# EasyEDA schematic Electronic Dice Schematic.json
TITLE: Sheet_1; REV: 1.0; Date: 2026-03-09; Sheet: 1/1; Drawn By: 752718; Company: Your Company
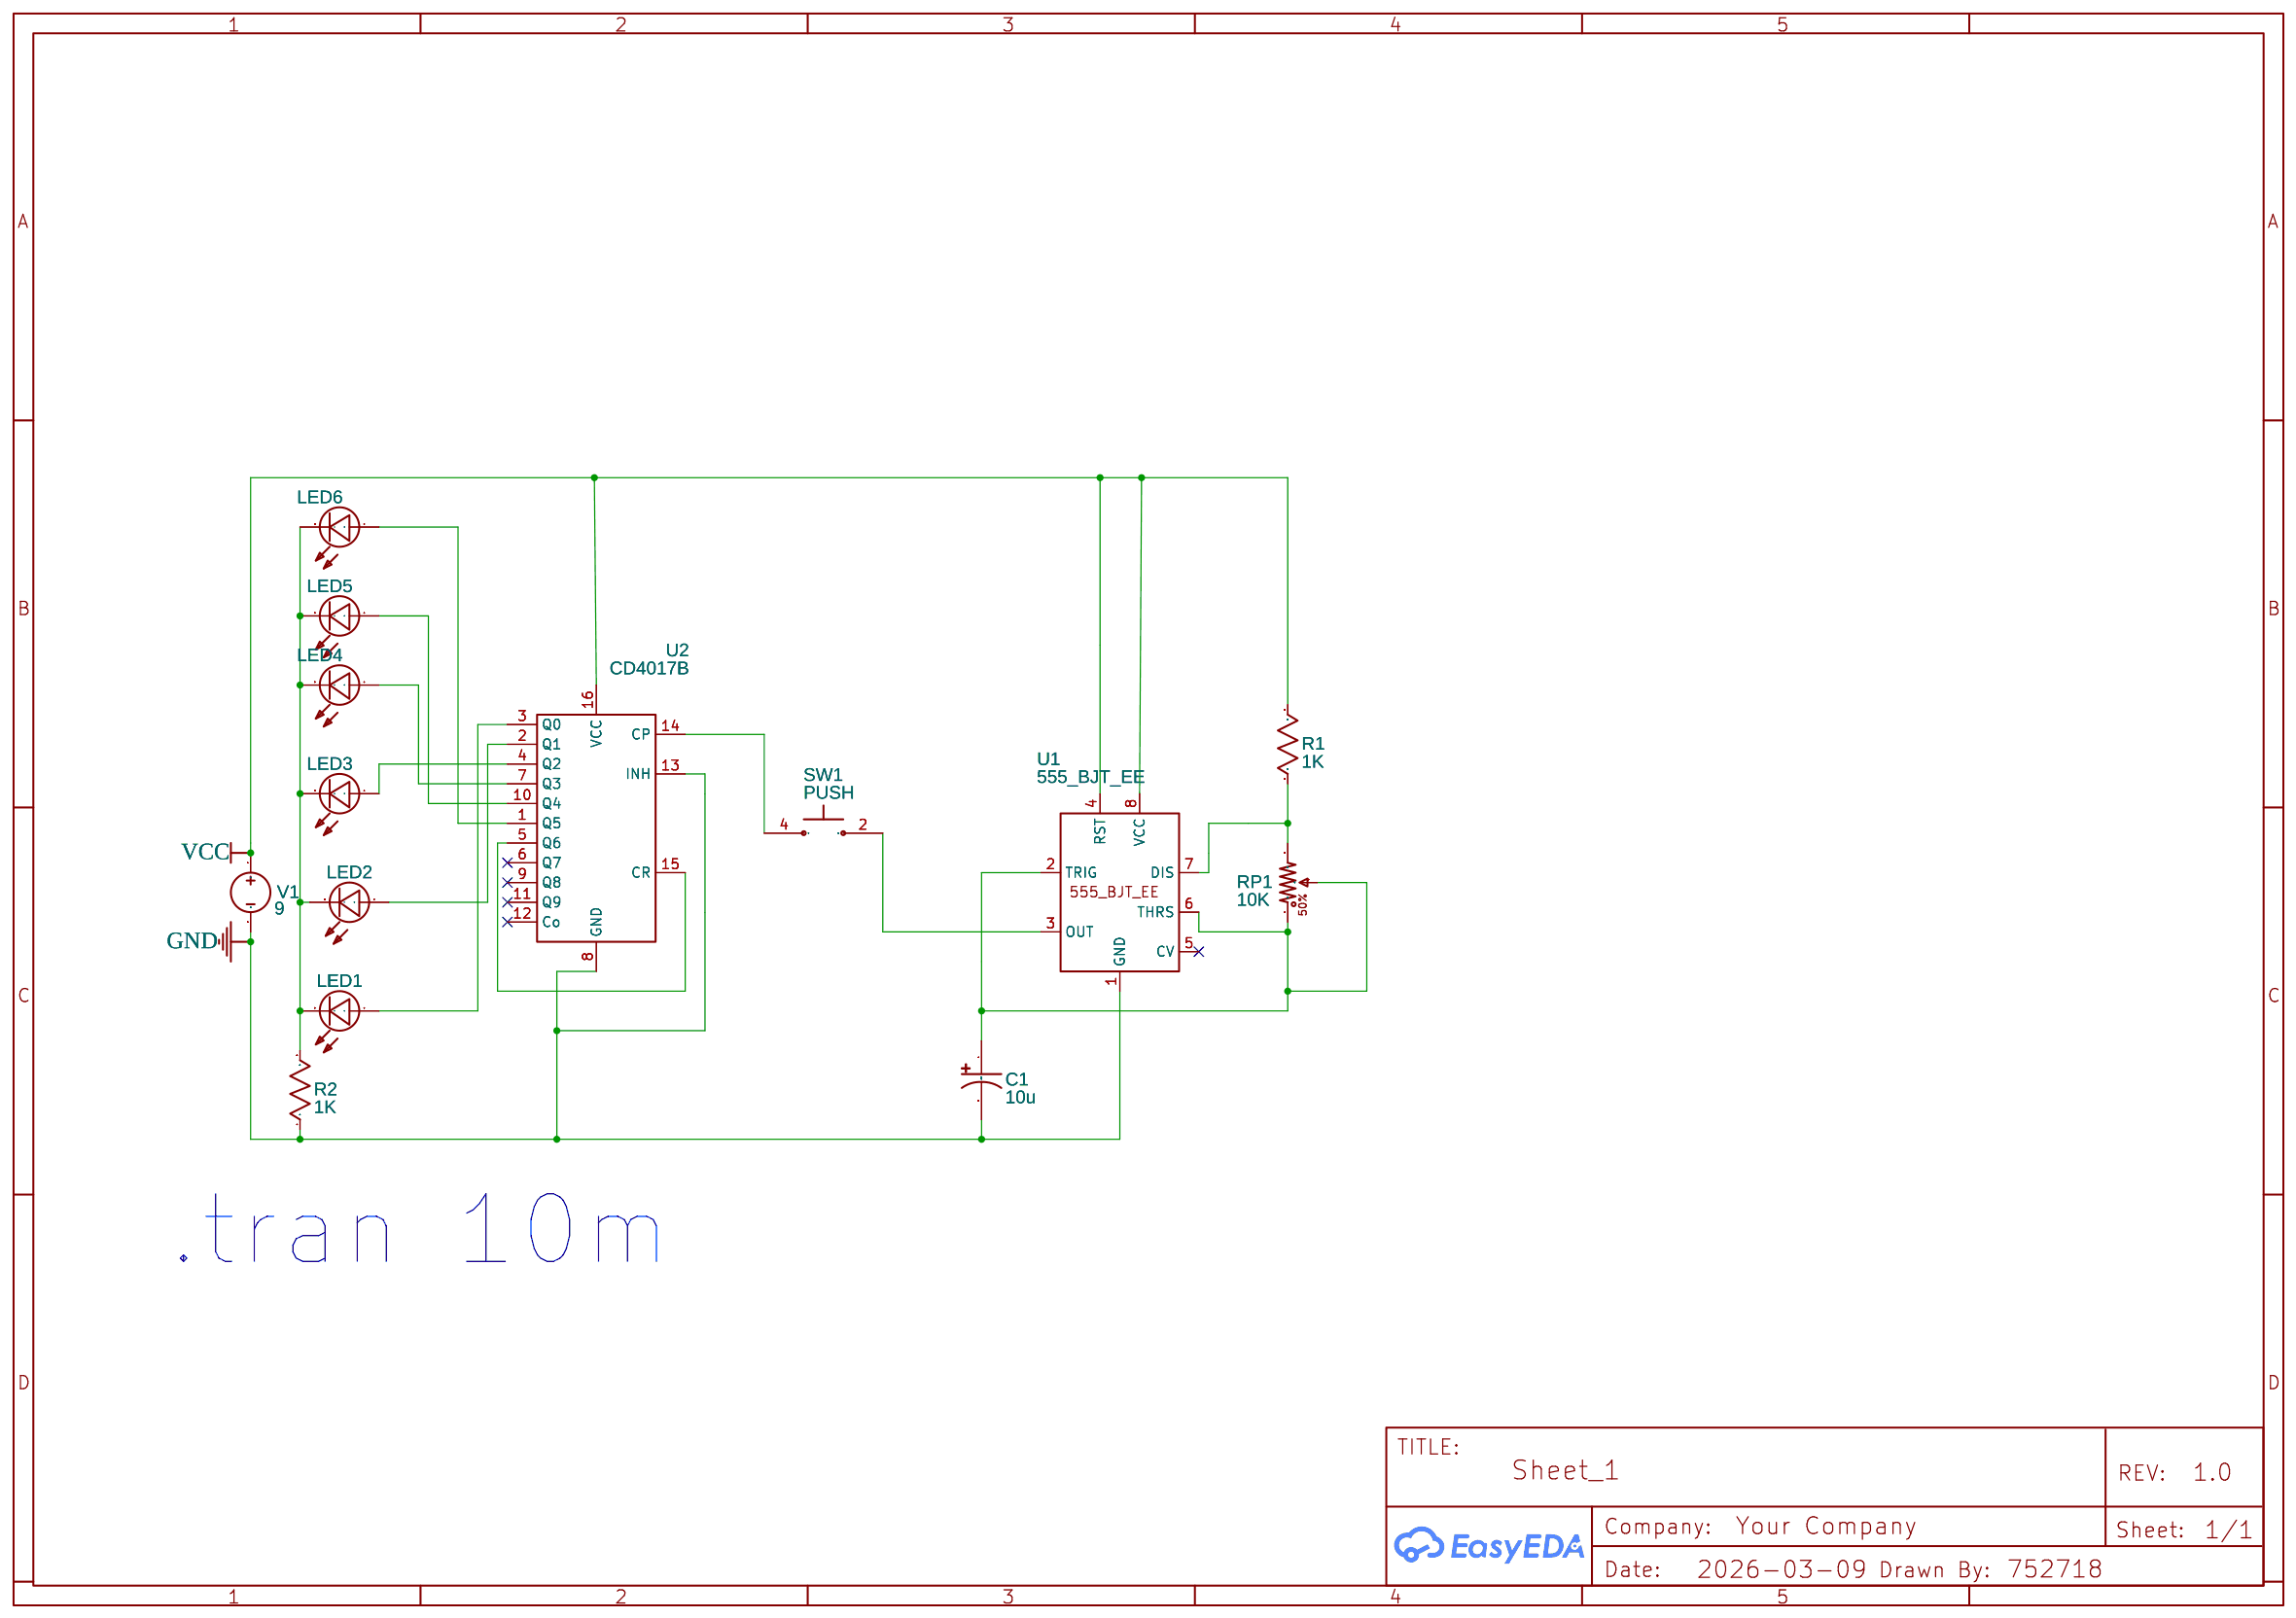
[diagram p0: schematic sheet]

## Parts
C1  10u  [CAPACITOR, 2.54MM PIN CAPACITOR]
LED1  LED  [LED TH]
LED2  LED  [LED TH]
LED3  LED  [LED TH]
LED4  LED  [LED TH]
LED5  LED  [LED TH]
LED6  LED  [LED TH]
R1  1K  [RESISTOR TH]
R2  1K  [RESISTOR TH]
RP1  10K  [POTENTIOMETER]
SW1  PUSH  [PUSHBUTTON]
U1  555_BJT_EE  [DIP 8]
U2  CD4017B  [4017 DECADE COUNTER]
V1  9  [BATTERY TH]

## Library data of the parts
C1 = Capacitor_Electrolytic_US: Supplier: YUJING; Contributor: EasyEDA; Capacitance: 1u
LED1-LED6 = LED: catid: 20; Contributor: 仿真库绘制; Color: Red; NameDisplay: 0
R1 R2 = Resistor_US: Resistance: 1k; Contributor: EasyEDA; Supplier: YUJING
RP1 = POTENTIOMETER: Resistance: 100K; K: 50
SW1 = PUSHBUTTON COPY: Contributor: jeniczek42; sourceId: 7ZJf9qkCU; sim: true
U1 = 555_BJT_EE: Contributor: EasyEDA; link: http://www.ti.com/lit/ds/symlink/ne555.pdf
U2 = 4KHEF: catid: 20; Contributor: foohshunweicc; Supplier: LCSC; sim: true
V1 = VDC: Contributor: EasyEDA; sim: true

## Nets
GND: C1.2 R2.1 U1.1(GND) U2.8(GND) U2.13(INH) V1.2
VCC: R1.2 U1.4(RST) U1.8(VCC) U2.16(VCC) V1.1
Net-(C1-1): C1.1 RP1.1 RP1.2 U1.2(TRIG) U1.6(THRS)
Net-(LED1-1): LED1.1(+) U2.3(Q0)
Net-(LED1-2): LED1.2(-) LED2.2(-) LED3.2(-) LED4.2(-) LED5.2(-) LED6.2(-) R2.2
Net-(LED2-1): LED2.1(+) U2.2(Q1)
Net-(LED3-1): LED3.1(+) U2.4(Q2)
Net-(LED4-1): LED4.1(+) U2.7(Q3)
Net-(LED5-1): LED5.1(+) U2.10(Q4)
Net-(LED6-1): LED6.1(+) U2.1(Q5)
Net-(R1-1): R1.1 RP1.3 U1.7(DIS)
Net-(SW1-2): SW1.2 U1.3(OUT)
Net-(SW1-4): SW1.4(1) U2.14(CP)
Net-(U2-5): U2.5(Q6) U2.15(CR)

Not connected (* = marked no-connect by the designer): U1 5(CV)*; U2 6(Q7)* 9(Q8)* 11(Q9)* 12(Co)*

## Notes on the sheet
- .tran 10m
